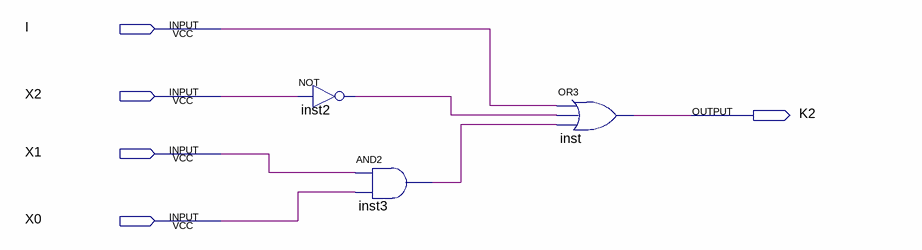
[diagram p0: schematic sheet]
// Quartus schematic K2.bdf as structural Verilog: 3 symbols, 5 pins
module K2 (
  input  I,
  input  X2,
  input  X1,
  input  X0,
  output K2
);

  wire inst2_out, inst3_out;

  not inst2 (inst2_out, X2);
  and inst3 (inst3_out, X1, X0);
  or inst (K2, I, inst2_out, inst3_out);
endmodule
